# EAGLE design Schematic (EAGLE 9.4.2)
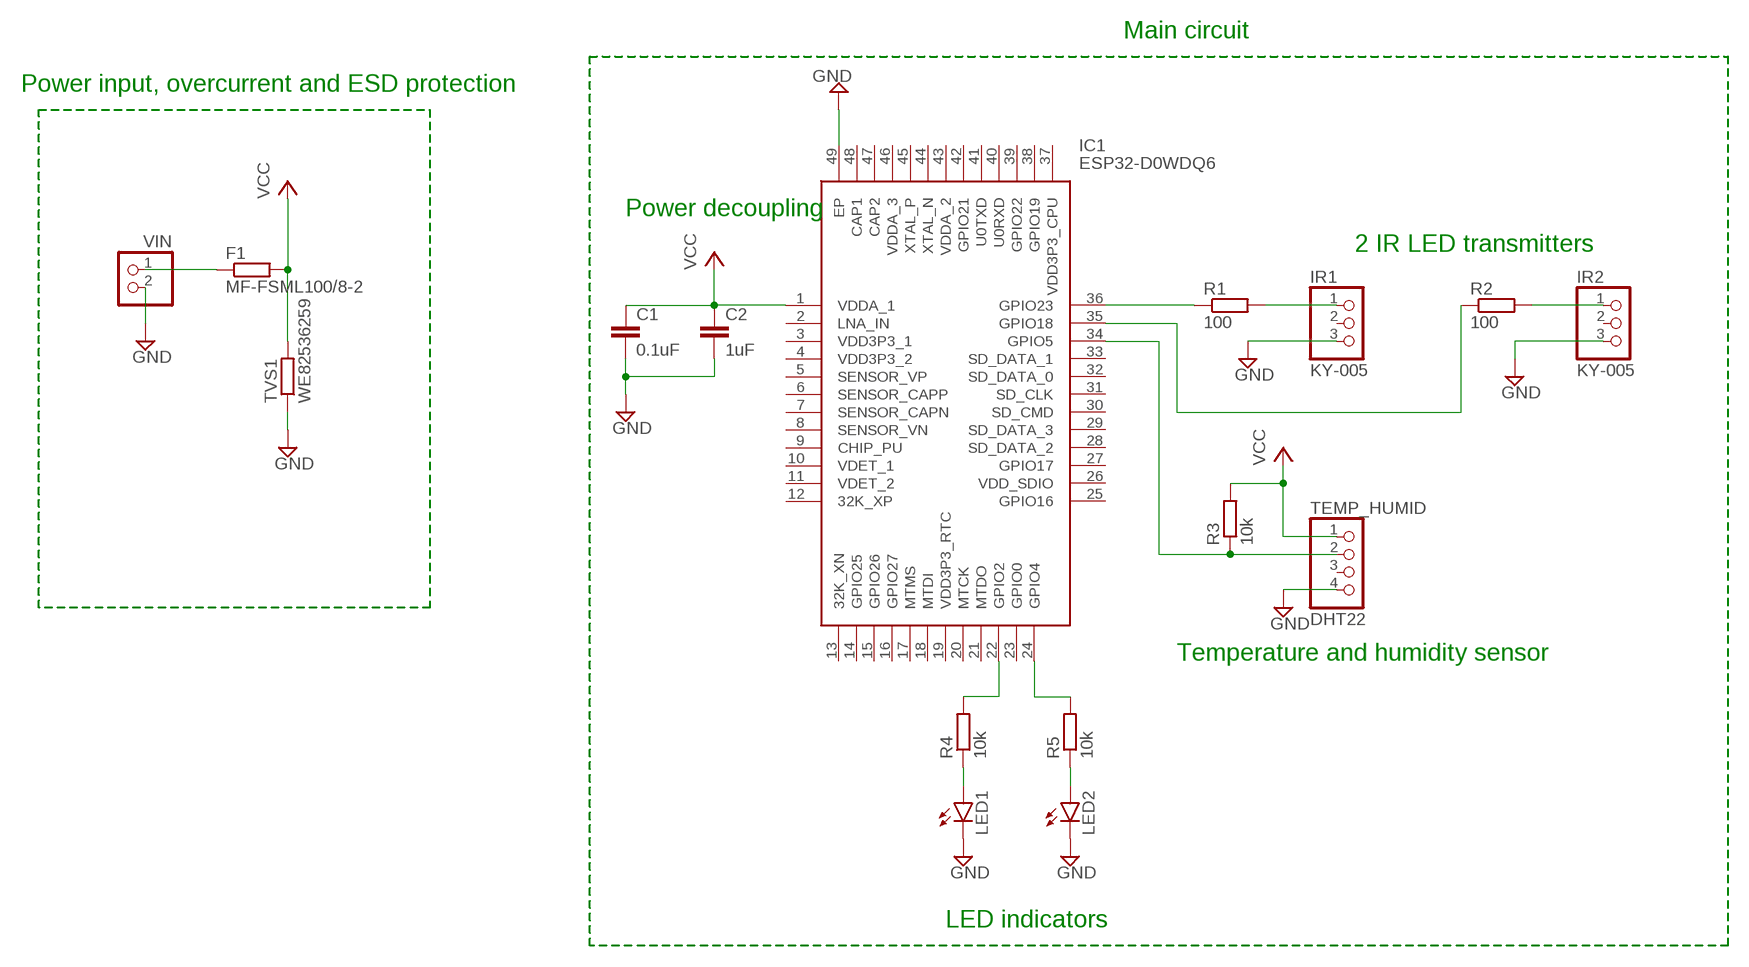
[diagram p0: schematic, sheet 1]

## Parts
C1  0.1uF  C-EUC0805  [C0805]
C2  1uF  C-EUC0805  [C0805]
F1  MF-FSML100/8-2  R-EU_R0603  [R0603]
IC1  ESP32-D0WDQ6  [QFN40P600X600X90-49N]
IR1  KY-005  PINHD-1X3  [1X03]
IR2  KY-005  PINHD-1X3  [1X03]
LED1  LED3MM  [LED3MM]
LED2  LED3MM  [LED3MM]
R1  100  R-EU_0207/12  [0207/12]
R2  100  R-EU_0207/12  [0207/12]
R3  10k  R-EU_0207/12  [0207/12]
R4  10k  R-EU_0207/12  [0207/12]
R5  10k  R-EU_0207/12  [0207/12]
TEMP_HUMID  DHT22  PINHD-1X4  [1X04]
TVS1  WE82536259  R-EU_R0603  [R0603]
VIN  PINHD-1X2  [1X02]

## Nets
GND: C1.2 C2.2 IC1.49(EP) IR1.3 IR2.3 LED1.K(C) LED2.K(C) TEMP_HUMID.4 TVS1.1 VIN.2
N$1: IR1.1 R1.2
N$2: IC1.36(GPIO23) R1.1
N$3: IR2.1 R2.2
N$4: IC1.35(GPIO18) R2.1
N$5: IC1.34(GPIO5) R3.1 TEMP_HUMID.2
N$6: LED2.A R5.1
N$7: LED1.A R4.1
N$8: IC1.22(GPIO2) R4.2
N$9: IC1.24(GPIO4) R5.2
N$10: F1.1 VIN.1
VCC: C1.1 C2.1 F1.2 IC1.1(VDDA_1) R3.2 TEMP_HUMID.1 TVS1.2
Unconnected: IC1.2(LNA_IN) IC1.3(VDD3P3_1) IC1.4(VDD3P3_2) IC1.5(SENSOR_VP) IC1.6(SENSOR_CAPP) IC1.7(SENSOR_CAPN) IC1.8(SENSOR_VN) IC1.9(CHIP_PU) IC1.10(VDET_1) IC1.11(VDET_2) IC1.12(32K_XP) IC1.13(32K_XN) IC1.14(GPIO25) IC1.15(GPIO26) IC1.16(GPIO27) IC1.17(MTMS) IC1.18(MTDI) IC1.19(VDD3P3_RTC) IC1.20(MTCK) IC1.21(MTDO) IC1.23(GPIO0) IC1.25(GPIO16) IC1.26(VDD_SDIO) IC1.27(GPIO17) IC1.28(SD_DATA_2) IC1.29(SD_DATA_3) IC1.30(SD_CMD) IC1.31(SD_CLK) IC1.32(SD_DATA_0) IC1.33(SD_DATA_1) IC1.37(VDD3P3_CPU) IC1.38(GPIO19) IC1.39(GPIO22) IC1.40(U0RXD) IC1.41(U0TXD) IC1.42(GPIO21) IC1.43(VDDA_2) IC1.44(XTAL_N) IC1.45(XTAL_P) IC1.46(VDDA_3) IC1.47(CAP2) IC1.48(CAP1) IR1.2 IR2.2 TEMP_HUMID.3

## Notes on the sheet
- Main circuit
- Power input, overcurrent and ESD protection
- Power decoupling
- 2 IR LED transmitters
- Temperature and humidity sensor
- LED indicators

## Library data of the parts
C1 C2 = rcl:C-EU: CAPACITOR, European symbol; SPICEPREFIX: C
F1 R1-R5 TVS1 = rcl:R-EU_: RESISTOR, European symbol; SPICEPREFIX: R
IC1 = ESP32-D0WDQ6:ESP32-D0WDQ6: RF System on a Chip - SoC SMD IC ESP32-D0WDQ6, Dual Core MCU, WiFi & Bluetooth Combo, QFN48-pin, 6x6mm Source: Datasheet <https://componentsearchengine.com/Datasheets/1/ESP32-D0WDQ6.pdf>; DESCRIPTION: RF System on a Chip - SoC SMD IC ESP32-D0WDQ6, Dual Core MCU, WiFi & Bluetooth Combo, QFN48-pin, 6x6mm; HEIGHT: 0.9mm; MANUFACTURER_NAME: Espressif Systems; MANUFACTURER_PART_NUMBER: ESP32-D0WDQ6; MOUSER_PART_NUMBER: 356-ESP32-D0WDQ6; MOUSER_PRICE-STOCK: https://www.mouser.com/Search/Refine.aspx?Keyword=356-ESP32-D0WDQ6
IR1 IR2 = pinhead:PINHD-1X3: PIN HEADER
LED1 LED2 = led:LED: LED OSRAM: - CHIPLED LG R971, LG N971, LY N971, LG Q971, LY Q971, LO R971, LY R971 LH N974, LH R974 LS Q976, LO Q976, LY Q976 LO Q996 - Hyper CHIPLED LW Q18S LB Q993, LB Q99A, LB R99A - SideLED LS A670, LO A670, LY A670, LG A670, LP A670 LB A673, LV A673, LT A673, LW A673 LH A674 LY A675 LS A676, LA A676, LO A676, LY A676, LW A676 LS A679, LY A679, LG A679 - Hyper Micro SIDELED® LS Y876, LA Y876, LO Y876, LY Y876 LT Y87S - SmartLED LW L88C, LW L88S LB L89C, LB L89S, LG L890 LS L89K, LO L89K, LY L89K LS L896, LA L896, LO L896, LY L896 - TOPLED LS T670, LO T670, LY T670, LG T670, LP T670 LSG T670, LSP T670, LSY T670, LOP T670, LYG T670 LG T671, LOG T671, LSG T671 LB T673, LV T673, LT T673, LW T673 LH T674 LS T676, LA T676, LO T676, LY T676, LB T676, LH T676, LSB T676, LW T676 LB T67C, LV T67C, LT T67C, LS T67K, LO T67K, LY T67K, LW E67C LS E67B, LA E67B, LO E67B, LY E67B, LB E67C, LV E67C, LT E67C LW T67C LS T679, LY T679, LG T679 LS T770, LO T770, LY T770, LG T770, LP T770 LB T773, LV T773, LT T773, LW T773 LH T774 LS E675, LA E675, LY E675, LS T675 LS T776, LA T776, LO T776, LY T776, LB T776 LHGB T686 LT T68C, LB T68C - Hyper Mini TOPLED® LB M676 - Mini TOPLED Santana® LG M470 LS M47K, LO M47K, LY M47K Source: http://www.osram.convergy.de LUXEON: - LUMILED® LXK2-PW12-R00, LXK2-PW12-S00, LXK2-PW14-U00, LXK2-PW14-V00 LXK2-PM12-R00, LXK2-PM12-S00, LXK2-PM14-U00 LXK2-PE12-Q00, LXK2-PE12-R00, LXK2-PE12-S00, LXK2-PE14-T00, LXK2-PE14-U00 LXK2-PB12-K00, LXK2-PB12-L00, LXK2-PB12-M00, LXK2-PB14-N00, LXK2-PB14-P00, LXK2-PB14-Q00 LXK2-PR12-L00, LXK2-PR12-M00, LXK2-PR14-Q00, LXK2-PR14-R00 LXK2-PD12-Q00, LXK2-PD12-R00, LXK2-PD12-S00 LXK2-PH12-R00, LXK2-PH12-S00 LXK2-PL12-P00, LXK2-PL12-Q00, LXK2-PL12-R00 Source: www.luxeon.com KINGBRIGHT: KA-3528ASYC Source: www.kingbright.com
TEMP_HUMID = pinhead:PINHD-1X4: PIN HEADER
VIN = pinhead:PINHD-1X2: PIN HEADER

## Board
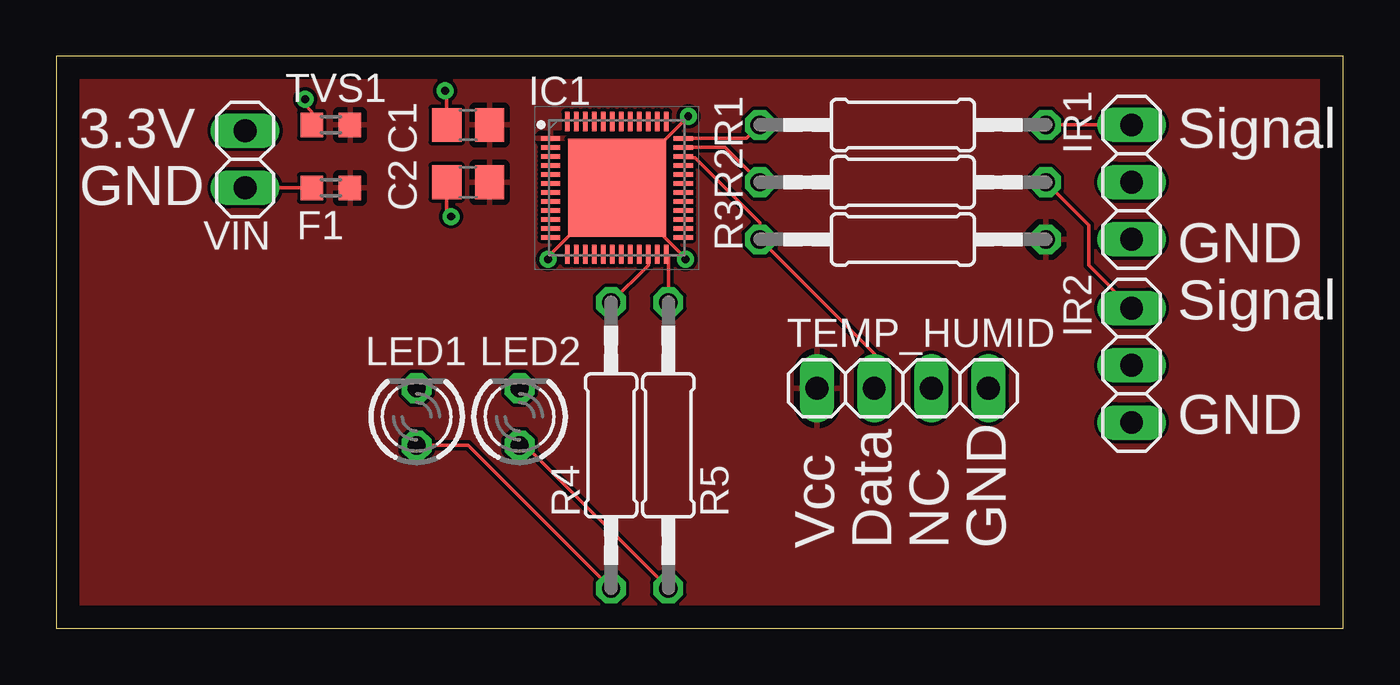
[diagram p1: board, top side]
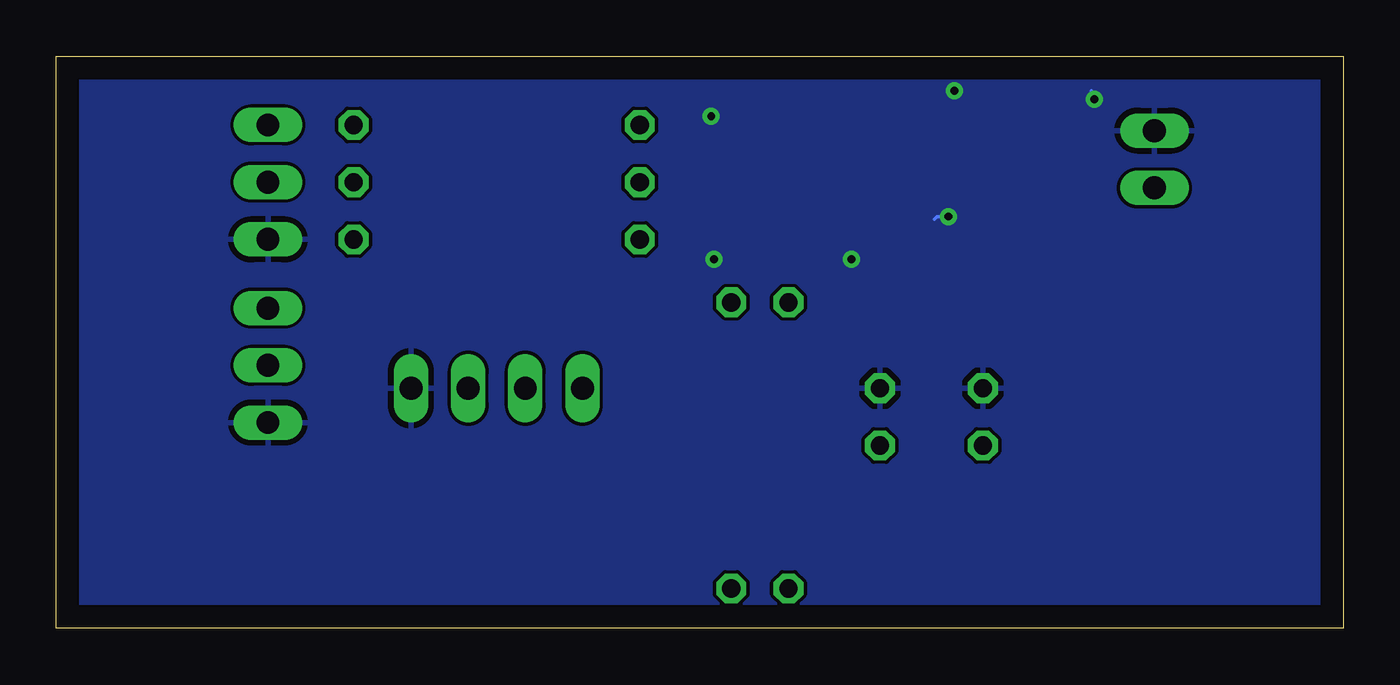
[diagram p2: board, bottom side, seen from below]

Size 57.15 x 25.4 mm. Coordinates in mm from the lower left corner, seen from the top.
Outline: 0,0 57.15,0 57.15,25.4 0,25.4 0,0
Copper layers (1*16): Top 0.035mm / dielectric 1.5mm / Bottom 0.035mm
Design rules "default *": minimum track width 6mil, minimum drill 0.35mm, track to track 6mil, track to pad 1mil, pad to pad 6mil, via to via 6mil, smd to smd 6mil, copper to edge 40mil, drill to drill 6mil, minimum pad ring 10mil, minimum via ring 8mil, stop-mask expansion 4mil, vias tented up to drill 0mil, thermal gap 10mil

### Footprints (pad centres in the part's own frame; a part is rotated, then mirrored left to right if it is on the bottom)
C0805 = smd 1.3 x 1.5: 1 -0.95,0; 2 0.95,0
R0603 = smd 1 x 1.1: 1 -0.85,0; 2 0.85,0
QFN40P600X600X90-49N = smd 0.85 x 0.2: 1 -2.95,2.2; 2 -2.95,1.8; 3 -2.95,1.4; 4 -2.95,1; 5 -2.95,0.6; 6 -2.95,0.2; 7 -2.95,-0.2; 8 -2.95,-0.6; 9 -2.95,-1; 10 -2.95,-1.4; 11 -2.95,-1.8; 12 -2.95,-2.2; 25 2.95,-2.2; 26 2.95,-1.8; 27 2.95,-1.4; 28 2.95,-1; 29 2.95,-0.6; 30 2.95,-0.2; 31 2.95,0.2; 32 2.95,0.6; 33 2.95,1; 34 2.95,1.4; 35 2.95,1.8; 36 2.95,2.2 | smd 0.2 x 0.85: 13 -2.2,-2.95; 14 -1.8,-2.95; 15 -1.4,-2.95; 16 -1,-2.95; 17 -0.6,-2.95; 18 -0.2,-2.95; 19 0.2,-2.95; 20 0.6,-2.95; 21 1,-2.95; 22 1.4,-2.95; 23 1.8,-2.95; 24 2.2,-2.95; 37 2.2,2.95; 38 1.8,2.95; 39 1.4,2.95; 40 1,2.95; 41 0.6,2.95; 42 0.2,2.95; 43 -0.2,2.95; 44 -0.6,2.95; 45 -1,2.95; 46 -1.4,2.95; 47 -1.8,2.95; 48 -2.2,2.95 | smd 4.35 x 4.35: 49 0,0
1X03 = drill 1.016 long: 1 -2.54,0; 2 0,0; 3 2.54,0
LED3MM = drill 0.813 octagon: A -1.27,0; K 1.27,0
0207/12 = drill 0.813 octagon: 1 -6.35,0; 2 6.35,0
1X04 = drill 1.016 long: 1 -3.81,0; 2 -1.27,0; 3 1.27,0; 4 3.81,0
1X02 = drill 1.016 long: 1 -1.27,0; 2 1.27,0

### Placement (x,y rotation side)
C1  18.29,22.35 180 top
C2  18.29,19.81 180 top
F1  12.19,19.56 0 top
IC1  24.89,19.56 0 top
IR1  47.75,19.81 270 top
IR2  47.75,11.68 270 top
LED1  16,9.4 90 top
LED2  20.57,9.4 90 top
R1  37.59,22.35 0 top
R2  37.59,19.81 0 top
R3  37.59,17.27 0 top
R4  24.64,8.13 90 top
R5  27.18,8.13 90 top
TEMP_HUMID  37.59,10.67 0 top
TVS1  12.19,22.35 0 top
VIN  8.38,20.83 90 top

### Tracks (layer width: path | path; a pad name or v marks a point on that pad's centre or on a via)
GND  (via drill 0.35)
  Top 0.152: TVS1.1 11.34,22.95 11.05,23.24 v11.05,23.5 | C1.2 17.34,23.81 v17.27,23.88 | C2.2 17.34,18.48 v17.53,18.29 | IC1.49 21.84,16.51 v21.84,16.38 | v28.07,22.73 26.67,21.34 26.67,17.7 27.94,16.43 v27.94,16.38
  Bottom 0.152: v11.05,23.5 11.05,23.75 11.18,23.88 | v17.27,23.88 17.4,23.88 | v17.53,18.29 18.03,18.29 18.16,18.16
  pour Bottom: 0,0 0,57.4 90.42,57.4 90.42,0
N$1
  Top 0.152: R1.2 IR1.1
N$2
  Top 0.152: IC1.36 30.65,21.76 R1.1
N$3
  Top 0.152: R2.2 45.85,17.91 45.85,16.13 IR2.1
N$4
  Top 0.152: IC1.35 29.7,21.36 R2.1
N$5
  Top 0.152: IC1.34 27.91,20.89 28.36,20.89 31.24,18.01 R3.1 36.32,12.19 TEMP_HUMID.2
N$6
  Top 0.152: LED2.A 20.83,8.13 R5.1
N$7
  Top 0.152: LED1.A 18.29,8.13 R4.1
N$8
  Top 0.152: IC1.22 26.29,16.13 R4.2
N$9
  Top 0.152: IC1.24 27.18,16.52 R5.2
N$10
  Top 0.152: VIN.1 F1.1
VCC
  pour Top: 0,0 0,54.36 89.41,54.36 89.41,0 70.61,0

### Text on the board
tPlace: 3.3V | Signal | GND | GND | Signal | GND | Vcc | Data | NC | GND